# Altium project BRZ_BATT_MANAGER.PrjPcb (part 2 of 2)

## Sheet STM32H730_PINOUT.SchDoc
size D; SheetNumber: 2; SheetTotal: 8
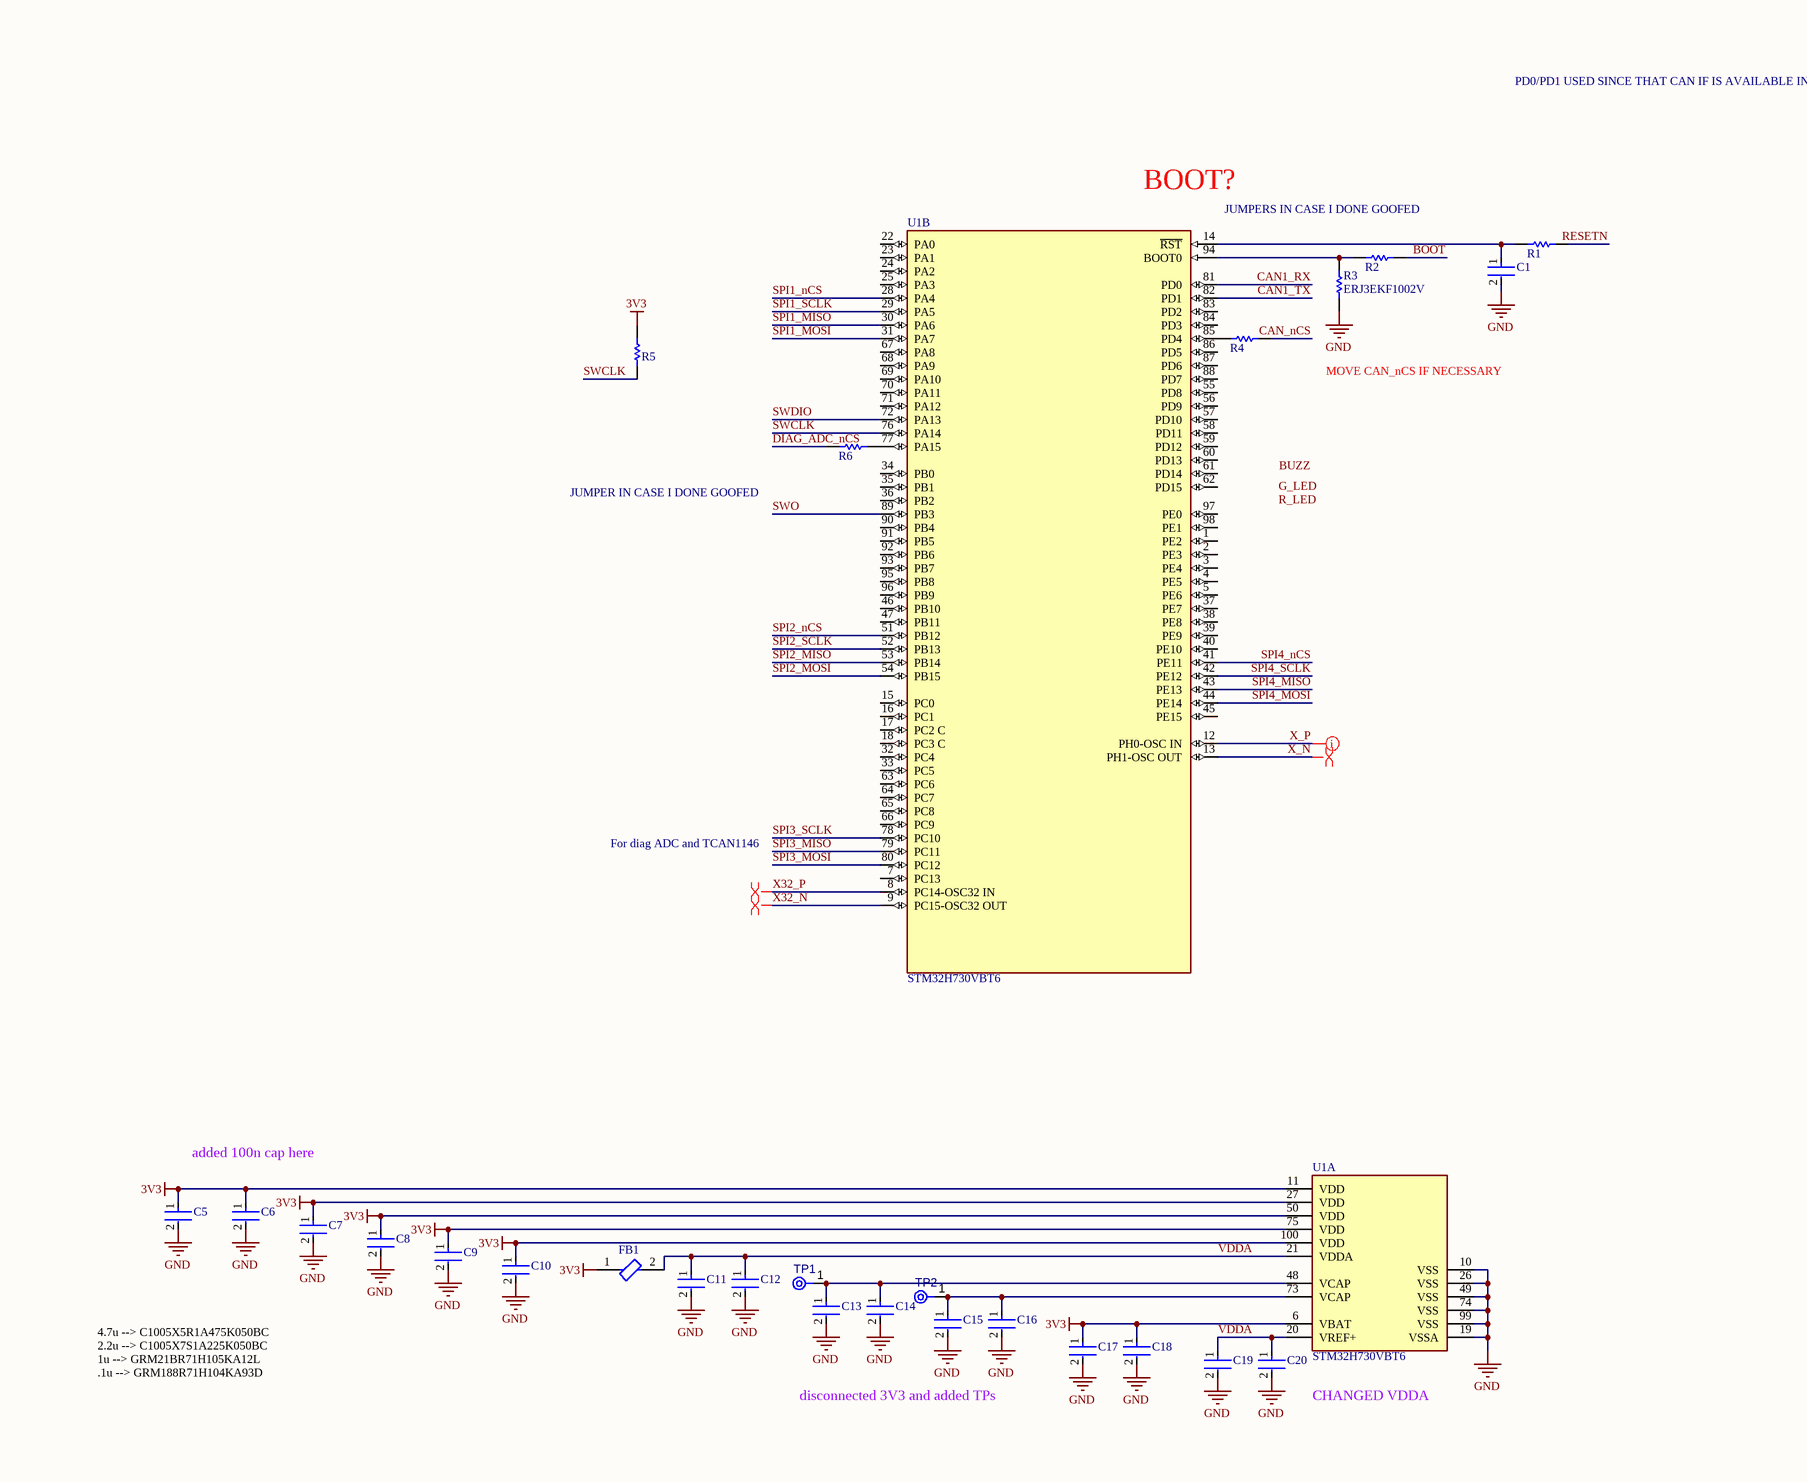
[diagram p5: STM32H730_PINOUT.SchDoc, top left]
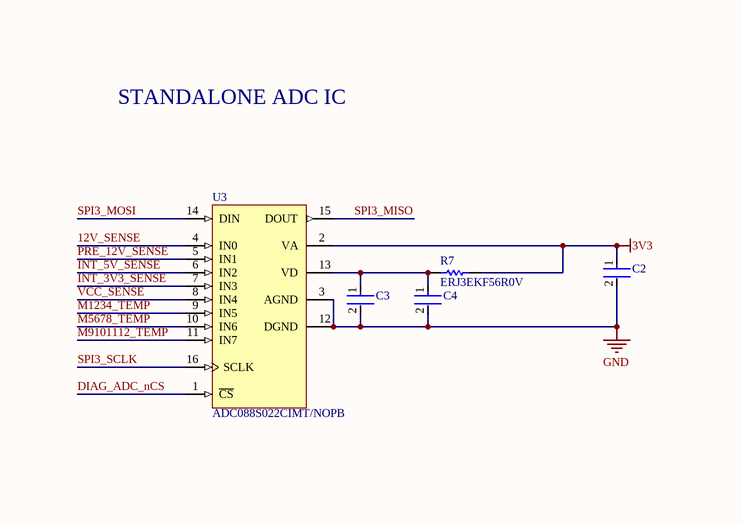
[diagram p6: STM32H730_PINOUT.SchDoc, top middle]
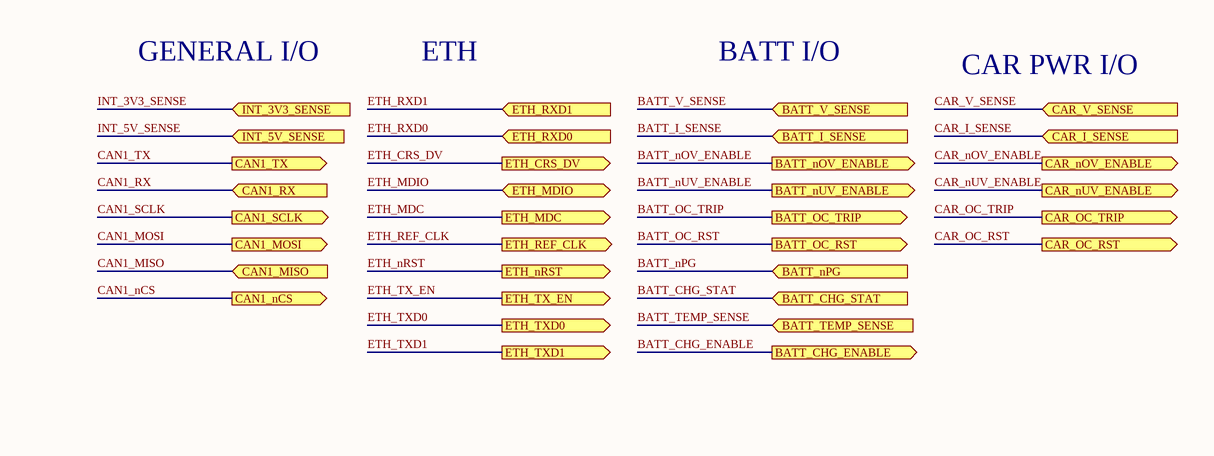
[diagram p7: STM32H730_PINOUT.SchDoc, top right]
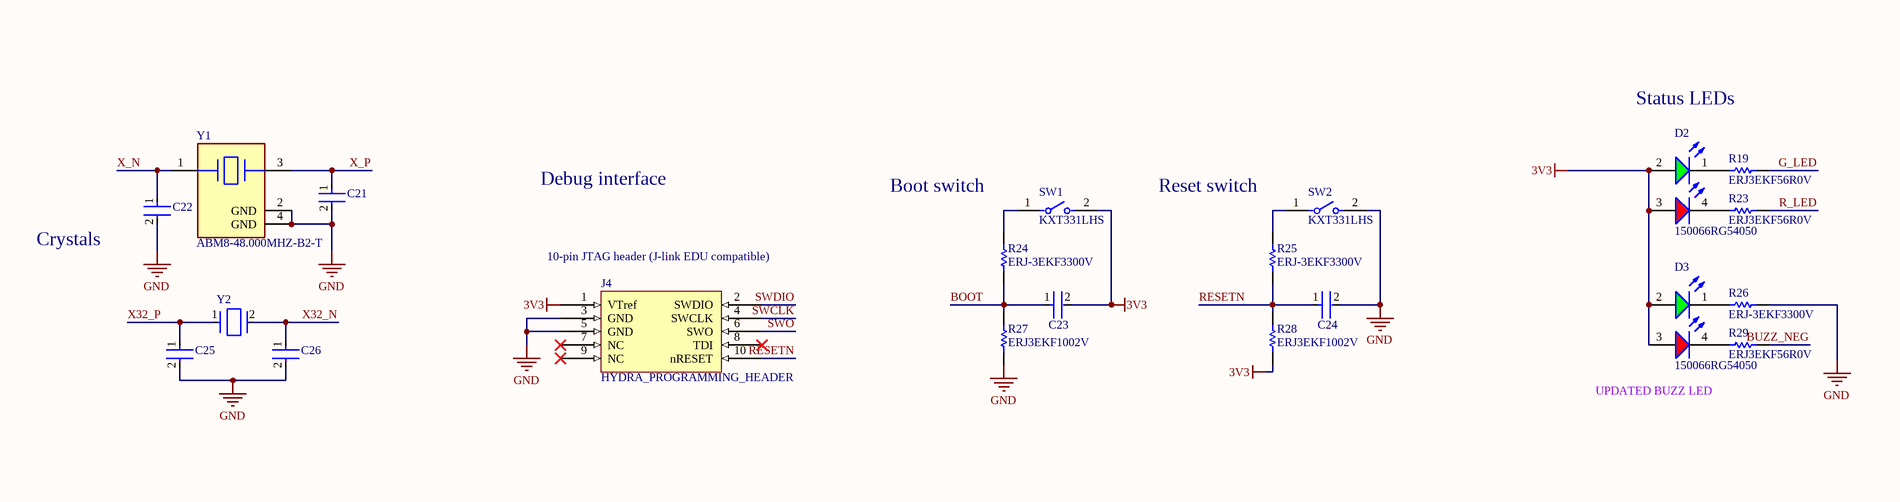
[diagram p8: STM32H730_PINOUT.SchDoc, bottom left]
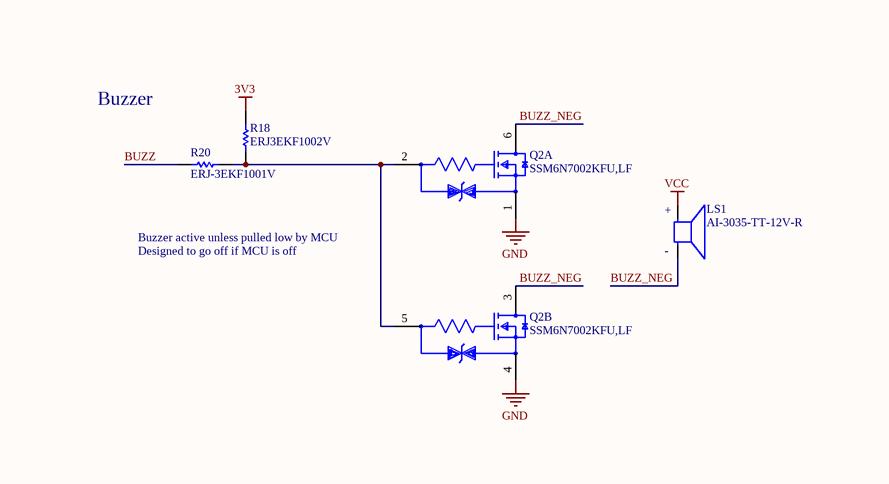
[diagram p9: STM32H730_PINOUT.SchDoc, bottom middle]
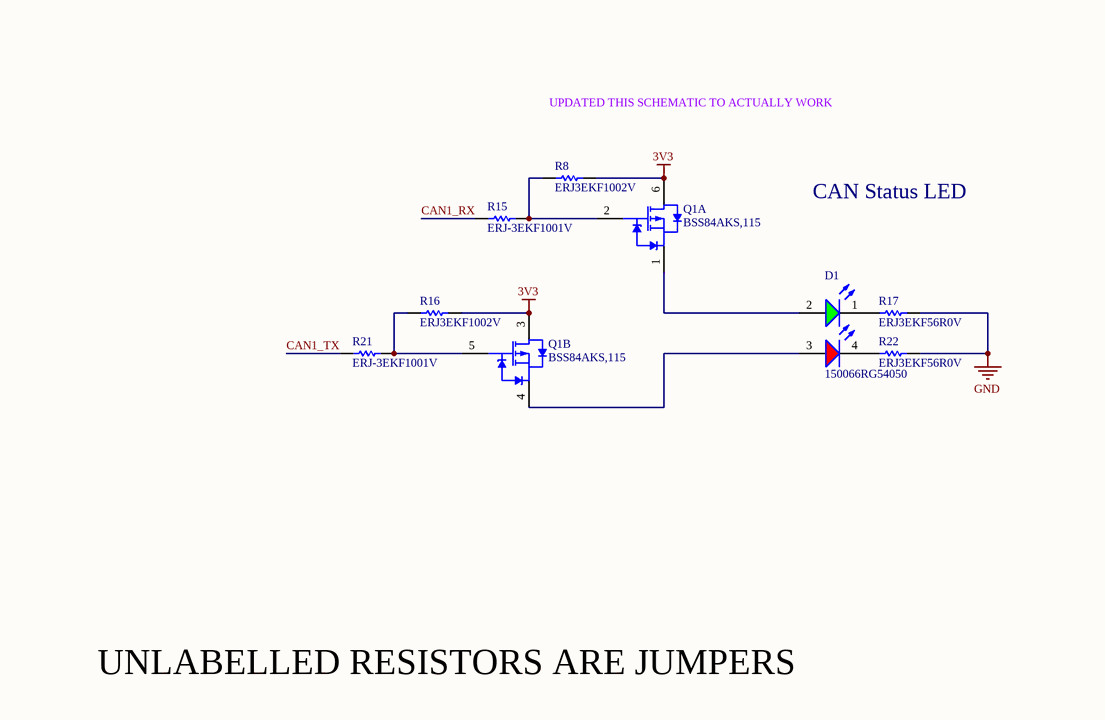
[diagram p10: STM32H730_PINOUT.SchDoc, bottom right]

### Parts
C1  GRM188R71H104KA93D  [FP-0402-L_1_0_0_05-W_0_5-IPC_A]  (value not drawn)
C2  GRM188R71H104KA93D  [FP-0402-L_1_0_0_05-W_0_5-IPC_A]  (value not drawn)
C3  GRM188R71H104KA93D  [FP-0402-L_1_0_0_05-W_0_5-IPC_A]  (value not drawn)
C4  GRM188R71H104KA93D  [FP-0402-L_1_0_0_05-W_0_5-IPC_A]  (value not drawn)
C5  C1005X5R1A475K050BC  [FP-0402-L_1_0_0_05-W_0_5-IPC_A]  (value not drawn)
C6  GRM188R71H104KA93D  [FP-0402-L_1_0_0_05-W_0_5-IPC_A]  (value not drawn)
C7  GRM188R71H104KA93D  [FP-0402-L_1_0_0_05-W_0_5-IPC_A]  (value not drawn)
C8  GRM188R71H104KA93D  [FP-0402-L_1_0_0_05-W_0_5-IPC_A]  (value not drawn)
C9  GRM188R71H104KA93D  [FP-0402-L_1_0_0_05-W_0_5-IPC_A]  (value not drawn)
C10  GRM188R71H104KA93D  [FP-0402-L_1_0_0_05-W_0_5-IPC_A]  (value not drawn)
C11  GRM21BR71H105KA12L  [FP-0402-L_1_0_0_05-W_0_5-IPC_A]  (value not drawn)
C12  GRM188R71H104KA93D  [FP-0402-L_1_0_0_05-W_0_5-IPC_A]  (value not drawn)
C13  C1005X7S1A225K050BC  [FP-0402-L_1_0_0_05-W_0_5-IPC_A]  (value not drawn)
C14  GRM188R71H104KA93D  [FP-0402-L_1_0_0_05-W_0_5-IPC_A]  (value not drawn)
C15  C1005X7S1A225K050BC  [FP-0402-L_1_0_0_05-W_0_5-IPC_A]  (value not drawn)
C16  GRM188R71H104KA93D  [FP-0402-L_1_0_0_05-W_0_5-IPC_A]  (value not drawn)
C17  GRM21BR71H105KA12L  [FP-0402-L_1_0_0_05-W_0_5-IPC_A]  (value not drawn)
C18  GRM188R71H104KA93D  [FP-0402-L_1_0_0_05-W_0_5-IPC_A]  (value not drawn)
C19  GRM21BR71H105KA12L  [FP-0402-L_1_0_0_05-W_0_5-IPC_A]  (value not drawn)
C20  GRM188R71H104KA93D  [FP-0402-L_1_0_0_05-W_0_5-IPC_A]  (value not drawn)
C21  DNO  [FP-0402-L_1_0_0_05-W_0_5-IPC_A]  (value not drawn)
C22  DNO  [FP-0402-L_1_0_0_05-W_0_5-IPC_A]  (value not drawn)
C23  GRM188R71H104KA93D  [FP-0402-L_1_0_0_05-W_0_5-IPC_A]  (value not drawn)
C24  GRM188R71H104KA93D  [FP-0402-L_1_0_0_05-W_0_5-IPC_A]  (value not drawn)
C25  04025A180FAT2A  [FP-0402-L_1_0_0_05-W_0_5-IPC_A]  (value not drawn)
C26  04025A180FAT2A  [FP-0402-L_1_0_0_05-W_0_5-IPC_A]  (value not drawn)
D1  150066RG54050  [WL-SBCD_0606]
D2  150066RG54050  [WL-SBCD_0606]
D3  150066RG54050  [WL-SBCD_0606]
FB1  BLM15PX601SN1D  [FP-BLM15-0_05-MFG]  (value not drawn)
J4  HYDRA_PROGRAMMING_HEADER  [3220-10-0300-00-Footprint-1]
LS1  AI-3035-TT-12V-R  [AI-3035-TT-12V-R-Footprint-1]
Q1  BSS84AKS,115  [NXP-SOT363_L]  (parts A,B of 2)
Q2  SSM6N7002KFU,LF  [FP-SSOP6-P-0_65A-MFG]  (parts A,B of 2)
R1  0402 JUMPER 0 OHM  [RESC1005X40X25NL05T05]  (value not drawn)
R2  0402 JUMPER 0 OHM  [RESC1005X40X25NL05T05]  (value not drawn)
R3  ERJ3EKF1002V  [RESC1609X55X30LL15T15]
R4  0402 JUMPER 0 OHM  [RESC1005X40X25NL05T05]  (value not drawn)
R5  ERJ3EKF1002V  [RESC1609X55X30LL15T15]  (value not drawn)
R6  0402 JUMPER 0 OHM  [RESC1005X40X25NL05T05]  (value not drawn)
R7  ERJ3EKF56R0V  [RESC1608X55X30NL15T15]
R8  ERJ3EKF1002V  [RESC1609X55X30LL15T15]
R15  ERJ-3EKF1001V  [RESC1608X55X30LL15T15]
R16  ERJ3EKF1002V  [RESC1609X55X30LL15T15]
R17  ERJ3EKF56R0V  [RESC1608X55X30NL15T15]
R18  ERJ3EKF1002V  [RESC1609X55X30LL15T15]
R19  ERJ3EKF56R0V  [RESC1608X55X30NL15T15]
R20  ERJ-3EKF1001V  [RESC1608X55X30LL15T15]
R21  ERJ-3EKF1001V  [RESC1608X55X30LL15T15]
R22  ERJ3EKF56R0V  [RESC1608X55X30NL15T15]
R23  ERJ3EKF56R0V  [RESC1608X55X30NL15T15]
R24  ERJ-3EKF3300V  [RESC1608X55X30LL15T15]
R25  ERJ-3EKF3300V  [RESC1608X55X30LL15T15]
R26  ERJ-3EKF3300V  [RESC1608X55X30LL15T15]
R27  ERJ3EKF1002V  [RESC1609X55X30LL15T15]
R28  ERJ3EKF1002V  [RESC1609X55X30LL15T15]
R29  ERJ3EKF56R0V  [RESC1608X55X30NL15T15]
SW1  KXT331LHS  [FP-KXT331LHS-MFG]
SW2  KXT331LHS  [FP-KXT331LHS-MFG]
TP1  TPAD6R  [TP06R]  (value not drawn)  (no BOM)
TP2  TPAD6R  [TP06R]  (value not drawn)  (no BOM)
U1  STM32H730VBT6  [FP-LQFP100-1L-IPC_C]  (parts A,B of 2)
U3  ADC088S022CIMT/NOPB  [MTC16_L]
Y1  ABM8-48.000MHZ-B2-T  [FP-ABM8-MFG]
Y2  ECS-.327-12.5-1210-TR  [FP-ECX-1210-MFG]  (value not drawn)

### Ports
BATT_CHG_ENABLE (out, see BRZ_BATT_MGR[4B]), BATT_CHG_STAT (in, see BRZ_BATT_MGR[4B]), BATT_I_SENSE (in, see BRZ_BATT_MGR[4B]), BATT_nOV_ENABLE (out, see BRZ_BATT_MGR[4B]), BATT_nPG (in, see BRZ_BATT_MGR[4B]), BATT_nUV_ENABLE (out, see BRZ_BATT_MGR[4B]), BATT_OC_RST (out, see BRZ_BATT_MGR[4B]), BATT_OC_TRIP (out, see BRZ_BATT_MGR[4B]), BATT_TEMP_SENSE (in, see BRZ_BATT_MGR[4B]), BATT_V_SENSE (in, see BRZ_BATT_MGR[4B]), CAN1_MISO (in, see BRZ_BATT_MGR[5A]), CAN1_MOSI (out, see BRZ_BATT_MGR[5A]), CAN1_nCS (out, see BRZ_BATT_MGR[5A]), CAN1_RX (in, see BRZ_BATT_MGR[5A]), CAN1_SCLK (out, see BRZ_BATT_MGR[5A]), CAN1_TX (out, see BRZ_BATT_MGR[5A]), CAR_I_SENSE (in, see BRZ_BATT_MGR[4C]), CAR_nOV_ENABLE (out, see BRZ_BATT_MGR[4C]), CAR_nUV_ENABLE (out, see BRZ_BATT_MGR[4C]), CAR_OC_RST (out, see BRZ_BATT_MGR[4C]), CAR_OC_TRIP (out, see BRZ_BATT_MGR[4C]), CAR_V_SENSE (in, see BRZ_BATT_MGR[4C]), ETH_CRS_DV (out, see BRZ_BATT_MGR[5C], ETH[1A]), ETH_MDC (out, see BRZ_BATT_MGR[5C], ETH[1A]), ETH_MDIO (bidir, see BRZ_BATT_MGR[5C], ETH[1A]), ETH_nRST (out, see BRZ_BATT_MGR[5C], ETH[1A]), ETH_REF_CLK (out, see BRZ_BATT_MGR[5C], ETH[1A]), ETH_RXD0 (in, see BRZ_BATT_MGR[5C], ETH[1A]), ETH_RXD1 (in, see BRZ_BATT_MGR[5C], ETH[1A]), ETH_TX_EN (out, see BRZ_BATT_MGR[5C], ETH[1A]), ETH_TXD0 (out, see BRZ_BATT_MGR[5C], ETH[1A]), ETH_TXD1 (out, see BRZ_BATT_MGR[5C], ETH[1A]), INT_3V3_SENSE (in, see BRZ_BATT_MGR[4A], INT_REG[4A]), INT_5V_SENSE (in, see BRZ_BATT_MGR[4A], INT_REG[4B])

### Nets
3V3: C2.1 C5.1 C6.1 C7.1 C8.1 C9.1 C10.1 C17.1 C18.1 C23.2 D2.2(A) D2.3(A) D3.2(A) D3.3(A) FB1.1 J4.1(VTref) Q1.3(D2) Q1.6(D1) R5.1 R7.1 R8.2 R16.2 R18.2 R28.1 SW1.2 U1.6(VBAT) U1.11(VDD) U1.27(VDD) U1.50(VDD) U1.75(VDD) U1.100(VDD) U3.2(VA)
GND: C1.2 C2.2 C3.2 C4.2 C5.2 C6.2 C7.2 C8.2 C9.2 C10.2 C11.2 C12.2 C13.2 C14.2 C15.2 C16.2 C17.2 C18.2 C19.2 C20.2 C21.2 C22.2 C24.2 C25.2 C26.2 J4.3(GND) J4.5(GND) Q2.1(Source1) Q2.4(Source2) R3.1 R17.1 R22.1 R26.2 R27.1 SW2.2 U1.10(VSS) U1.19(VSSA) U1.26(VSS) U1.49(VSS) U1.74(VSS) U1.99(VSS) U3.3(AGND) U3.12(DGND) Y1.2(GND) Y1.4(GND)
VCC: LS1.P
12V_SENSE: U3.4(IN0)
BOOT: C23.1 R2.2 R24.1 R27.2
BUZZ: R20.1
BUZZ_NEG: LS1.N Q2.3(Drain2) Q2.6(Drain1) R29.1
CAN1_RX: R15.1 U1.81(PD0) ; port CAN1_RX
CAN1_TX: R21.1 U1.82(PD1) ; port CAN1_TX
CAN_nCS: R4.2
DIAG_ADC_nCS: R6.1 U3.1(~{CS})
ETH_CRS_DV: port ETH_CRS_DV
ETH_MDC: port ETH_MDC
ETH_MDIO: port ETH_MDIO
ETH_nRST: port ETH_nRST
ETH_REF_CLK: port ETH_REF_CLK
ETH_RXD0: port ETH_RXD0
ETH_RXD1: port ETH_RXD1
ETH_TX_EN: port ETH_TX_EN
ETH_TXD0: port ETH_TXD0
ETH_TXD1: port ETH_TXD1
G_LED: R19.1
INT_3V3_SENSE: U3.7(IN3) ; port INT_3V3_SENSE
INT_5V_SENSE: U3.6(IN2) ; port INT_5V_SENSE
M1234_TEMP: U3.9(IN5)
M5678_TEMP: U3.10(IN6)
M9101112_TEMP: U3.11(IN7)
PRE_12V_SENSE: U3.5(IN1)
R_LED: R23.1
RESETN: C24.1 J4.10(nRESET) R1.2 R25.1 R28.2
SPI1_MISO: U1.30(PA6)
SPI1_MOSI: U1.31(PA7)
SPI1_nCS: U1.28(PA4)
SPI1_SCLK: U1.29(PA5)
SPI2_MISO: U1.53(PB14)
SPI2_MOSI: U1.54(PB15)
SPI2_nCS: U1.51(PB12)
SPI2_SCLK: U1.52(PB13)
SPI3_MISO: U1.79(PC11) U3.15(DOUT)
SPI3_MOSI: U1.80(PC12) U3.14(DIN)
SPI3_SCLK: U1.78(PC10) U3.16(SCLK)
SPI4_MISO: U1.43(PE13)
SPI4_MOSI: U1.44(PE14)
SPI4_nCS: U1.41(PE11)
SPI4_SCLK: U1.42(PE12)
SWCLK: J4.4(SWCLK) R5.2 U1.76(PA14)
SWDIO: J4.2(SWDIO) U1.72(PA13)
SWO: J4.6(SWO) U1.89(PB3)
VCC_SENSE: U3.8(IN4)
VDDA: C11.1 C12.1 C19.1 C20.1 FB1.2 U1.20(VREF+) U1.21(VDDA)
X32_N: C26.1 U1.9(PC15-OSC32_OUT) Y2.2(Out/In)
X32_P: C25.1 U1.8(PC14-OSC32_IN) Y2.1(In/Out)
X_N: C22.1 U1.13(PH1-OSC_OUT) Y1.1
X_P: C21.1 U1.12(PH0-OSC_IN) Y1.3
NetC1_1: C1.1 R1.1 U1.14(~{RST})
NetC3_1: C3.1 C4.1 R7.2 U3.13(VD)
NetC13_1: C13.1 C14.1 TP1.1(TP) U1.48(VCAP)
NetC15_1: C15.1 C16.1 TP2.1(TP) U1.73(VCAP)
NetD1_1: D1.1(K) R17.2
NetD1_2: D1.2(A) Q1.1(S1)
NetD1_3: D1.3(A) Q1.4(S2)
NetD1_4: D1.4(K) R22.2
NetD2_1: D2.1(K) R19.2
NetD2_4: D2.4(K) R23.2
NetD3_1: D3.1(K) R26.1
NetD3_4: D3.4(K) R29.2
NetQ1_2: Q1.2(G1) R8.1 R15.2
NetQ1_5: Q1.5(G2) R16.1 R21.2
NetQ2_2: Q2.2(Gate1) Q2.5(Gate2) R18.1 R20.2
NetR2_1: R2.1 R3.2 U1.94(BOOT0)
NetR4_1: R4.1 U1.85(PD4)
NetR6_2: R6.2 U1.77(PA15)
NetR24_2: R24.2 SW1.1
NetR25_2: R25.2 SW2.1

Not connected (* = marked no-connect by the designer): J4 7(NC)* 8(TDI)* 9(NC)*; U1 1(PE2) 2(PE3) 3(PE4) 4(PE5) 5(PE6) 7(PC13) 15(PC0) 16(PC1) 17(PC2_C) 18(PC3_C) 22(PA0) 23(PA1) 24(PA2) 25(PA3) 32(PC4) 33(PC5) 34(PB0) 35(PB1) 36(PB2) 37(PE7) 38(PE8) 39(PE9) 40(PE10) 45(PE15) 46(PB10) 47(PB11) 55(PD8) 56(PD9) 57(PD10) 58(PD11) 59(PD12) 60(PD13) 61(PD14) 62(PD15) 63(PC6) 64(PC7) 65(PC8) 66(PC9) 67(PA8) 68(PA9) 69(PA10) 70(PA11) 71(PA12) 83(PD2) 84(PD3) 86(PD5) 87(PD6) 88(PD7) 90(PB4) 91(PB5) 92(PB6) 93(PB7) 95(PB8) 96(PB9) 97(PE0) 98(PE1)

### Layout directives
differential pair: X32_N, X32_P, X_N, X_P

### Notes on the sheet
- GENERAL I/O
- ETH
- BATT I/O
- PD0/PD1 USED SINCE THAT CAN IF IS AVAILABLE IN BOOTLOADER MODE
- CAR PWR I/O
- (near U1) BOOT?
- JUMPERS IN CASE I DONE GOOFED
- MOVE CAN_nCS IF NECESSARY
- STANDALONE ADC IC
- JUMPER IN CASE I DONE GOOFED
- For diag ADC and TCAN1146
- added 100n cap here
- disconnected 3V3 and added TPs
- CHANGED VDDA
- 4.7u --> C1005X5R1A475K050BC
  2.2u --> C1005X7S1A225K050BC
  1u --> GRM21BR71H105KA12L
  .1u --> GRM188R71H104KA93D
- UPDATED THIS SCHEMATIC TO ACTUALLY WORK
- CAN Status LED
- Status LEDs
- Buzzer
- Debug interface
- Boot switch
- Reset switch
- (near C22) Crystals
- (near J4) 10-pin JTAG header (J-link EDU compatible)
- Buzzer active unless pulled low by MCU
- Designed to go off if MCU is off
- UPDATED BUZZ LED
- UNLABELLED RESISTORS ARE JUMPERS
- Labels drawn without touching a wire or pin: BUZZ, G_LED, R_LED
- (in symbol CMP-00027-00003-1) +; -

### Library data of the parts
C1-C26 = CMP-001-00058-1: LARGE PADS, 0402 CAP, CHANGE COMMENT TO MATCH REAL P/N; Capacitor Type: Ceramic; Min Operating Temperature: -55°C; Mounting Technology: Surface Mount; Pins: 2; Case/Package: 0402; RoHS Compliant: Yes; Max Operating Temperature: 85°C
D1-D3 = CMP-004-00034-2: Led, Red/Grn, 180Mcd/230Mcd, 624Nm/525Nm Rohs Compliant: Yes
FB1 = CMP-0686-00252-4: Chip Ferrite Bead, 0402, 600Ω @ 100MHz, 0.23Ω, 25%, 900mA; Number of Circuits: 1; Impedance: 600R; DC Resistance (DCR): 230mR; Material: Steel; Length: 1mm; Package Quantity: 10000; Height: 0.5mm; Width: 0.5mm; Max DC Current: 900mA; Number of Lines: 1; Termination: SMD/SMT; Packaging: Tape and Reel; Lead Free: Lead Free; Min Operating Temperature: -55°C; Max Operating Temperature: 125°C; Max Current Rating: 900mA; Case Code (Imperial): 0402; Number of Pins: 2; Current Rating: 900mA; Test Frequency: 100MHz; Case/Package: 0402; Tolerance: 25%; Case Code (Metric): 1005
J4 = CMP-002-00075-1: CONN HEADER SMD 10POS 1.27MM (specifically compatible with J-Link EDU cable) PN: 3220-10-0300-00
LS1 = CMP-00027-00003-1: Audio Indicator 12V 12mA 110dBA 3.5KHz Resonant Frequency Thru-Hole
Q1 = CMP-1259-00116-1: Dual P-Channel Trench MOSFET, -50 V, -0.16 A, -55 to 150 degC, 6-Pin SOT363, Tape and Reel; Manufacturer: NXP Semiconductors; VGSth [typ] (V): -1.6; Automotive Qualified: Y; Channel Type: P; IDM [max] (A): -0.64; Packing: Tape & Reel; Mounting Technology: Surface Mount; PackageDescription: 6-Pin Small Outline Transistor Package, Body 2 x 1.25 mm, Pitch 0.65 mm; ComponentLink2URL: http://www.nxp.com/documents/data_sheet/BSS84AKS.pdf; ComponentLink3URL: http://www.nxp.com/documents/outline_drawing/sot363_po.pdf; PartNumber: BSS84AKS,115; PackageReference: SOT363; PackageVersion: 06-03-16, 03/2006; ComponentLink3Description: Package Specification; ComponentLink2Description: Datasheet; ComponentLink1Description: Manufacturer URL; VDS [max] (V): -50; Code_JEITA: SC-88; ID [max] (A): -0.16; DatasheetVersion: Rev. 1; ComponentLink1URL: http://www.nxp.com/
Q2 = CMP-35916-000009-1: MOSFET 2N-CH 60V 0.3A; Input Capacitance: 40pF; Continuous Drain Current (ID): 300mA; Max Power Dissipation: 285mW; FET Type: 2 N-Channel; Rds On Max: 1.5R; Mount: Surface Mount; Drain to Source Voltage (Vdss): 60V; Packaging: Tape and Reel
R1 R2 R4 R6 = CMP-009-00206-2: READ THE NAME
R3 R5 R8 R16 R18 R27 R28 = CMP-1012-00623-3: Chip Resistor, 10 KOhm, +/- 1%, 0.1 W, -55 to 155 degC, 0603 (1608 Metric), RoHS, Tape and Reel; Manufacturer: Panasonic; Voltage Rating: 75V; Case\/Package: 0603; Power Rating: 100mW; Resistance: 10KOhm; Temperature Coefficient: 100ppm\/degreesC; Number of Pins: 2; Package Reference: 603; Depth: 0.8mm; Mount: SurfaceMount; Package Description: 2-Pin Surface Mount Device, Body 1.6 x 0.85 mm; Datasheet Version: 02/2017; Length: 1.6mm; Lead Free: LeadFree; Height: 0.45mm; Number of Terminations: 2; Max Power Dissipation: 100mW; Min Operating Temperature: -55degC; Datasheet URL: https://industrial.panasonic.com/cdbs/www-data/pdf/RDA0000/AOA0000C304.pdf; Termination: SMD/SMT; Case Code (Metric): 1608; Case Code (Imperial): 0603; Tolerance: 1%; Max Operating Temperature: 155degC; RoHSCompliant: true; Voltage Rating (DC): 75V; Radiation Hardening: No; Packaging: TapeandReel; Composition: ThickFilm; Mounting Technology: SurfaceMount; Manufacturer URL: http://www.panasonic.com/; Width: 0.031inch; REACH SVHC: NoSVHC; Contact Plating: Tin; Military Standard: Not; Package Quantity: 1
R7 R17 R19 R22 R23 R29 = CMP-2000-00572-1: Manufacturer: Panasonic; Part Number: ERJ3EKF56R0V
R15 R20 R21 = CMP-2000-00180-1: Manufacturer: Panasonic; Part Number: ERJ-3EKF1001V
R24-R26 = CMP-2000-00435-2: Chip Resistor, 330 Ohm, +/- 1%, 0.1 W, -55 to 155 degC, 0603 (1608 Metric), RoHS, Tape and Reel; Gender: Male; Mating Cycles: 10000; Current Rating: 500 mA; Voltage Rating: 10 V; REACH SVHC: No SVHC; PackageDescription: 2-Pin Surface Mount Device, Body 1.6 x 0.85 mm; Contact Finish: Gold; Pins: 8; ComponentLink1Description: Manufacturer URL; Packaging: Tape and Reel; Max Operating Temperature: 85 degC; Contact Material: Copper; Height: 1.45 mm; Width: 1.45 mm; DatasheetVersion: Apr-15; Package Quantity: 1500; Contact Plating: Gold; PackageReference: 0603; Mount: Surface Mount; Lead Pitch: 1.1 mm; Min Operating Temperature: -25 degC; ComponentLink1URL: http://www.panasonic.com/; ComponentLink2URL: http://industrial.panasonic.com/cdbs/www-data/pdf/RDA0000/AOA0000C86.pdf; Length: 13.7 mm; ComponentLink2Description: Datasheet; RoHSCompliant: true
SW1 SW2 = CMP-10040-000029-1: SWITCH TACTILE SPST-NO 0.02A 15V; Operating Force: 240gf; Switch Travel: 0.13mm; Illumination Type: Non-Illuminated; Throw Configuration: SPST; Number of Ports: 1; Current Rating: 5A; Mechanical Life: 500000Cycles; Switch Function: Off-Mom; Connector Type: USB; Actuator Type: Standard; Gender: Receptacle; Number of Contacts: 24; Contact Plating: Gold; Insulation Color: Black; Min Operating Temperature: -40°C; Packaging: Tape and Reel; Flammability Rating: UL94 V-0; Max Operating Temperature: 85°C; Termination: Solder; Mount: Surface Mount
TP1 TP2 = CMP-00028-00002-2: 0.6mm round; Pins: 1
U1 = CMP-12105-000107-1: IC MCU 32BIT 128KB FLASH 100LQFP
U3 = CMP-0054-00372-2: 8-Channel, 50 kSPS to 200 kSPS, 8-Bit A/D Converter, 16-pin TSSOP, Pb-Free; Manufacturer: National Semiconductor; PackageTopMarking: NSUZXYTT*88S022*CIMT; CompType: ADC IC; PowerWise: Y; ComponentLink2URL: http://www.national.com/pf/AD/ADC088S022.html; RoHS: Y; PackageDescription: Molded TSSOP, Jedec, 5 x 4.4 x 0.9mm Body, 16 Lead, 0.65mm Pitch; DatasheetVersion: Feb-2010; PinCount: 16; ComponentLink1Description: ADC088S022 Datasheet; Code_JEDEC: MO-153-AB; ComponentLink3URL: http://www.national.com/packaging/folders/mtc16.html; PackageVersion: revD, Jun-2003; ComponentLink3Description: MTC16 Package Page; RevisionNote: Component URLs added; ComponentLink1URL: http://www.national.com/ds/AD/ADC088S022.pdf; ComponentLink2Description: ADC088S022 Web Page; PackageReference: MTC16
Y1 = CMP-27762-011708-1: Crystal 48MHz ±20ppm 18pF SMD-4 3.2mm x 2.5mm; Series Resistance: 35R; Frequency Stability: 50ppm; Package Quantity: 1000; Packaging: Tape and Reel; Mount: Surface Mount; Length: 3.2mm; Load Capacitance: 18pF; Max Operating Temperature: 70°C; Operating Frequency: 48 MHz; RoHS Compliant: Yes; Series: ABM8; Frequency Tolerance: 20ppm; Lead Free: Lead Free; Min Operating Temperature: -20°C; Case/Package: CSMD; Number of Pins: 4; Height: 0.031inch; ESR (Equivalent Series Resistance): 35R; Frequency: 48MHz; Radiation Hardening: No; Width: 0.098inch; Tolerance: 20ppm; Termination: SMD/SMT; Depth: 2.5mm; Resistor Type: Ceramic; REACH SVHC: No SVHC
Y2 = CMP-40224-000006-1: CRYSTAL 32.7680KHZ 12.5PF SMD; Manufacturer: ECS International; Frequency: 32.768kHz; Esr: 90kΩ; Tolerance: 20ppm; Device Class L1: Passive Components; Load Capacitance: 12.5pF; Temperature: -40°C to +85°C; ComponentLink2URL: https://ecsxtal.com/store/pdf/ECX-1210.pdf; Series: ECX-1210; Octopart: https://octopart.com/ecs-.327-12.5-1210-tr-ecs+international-81221340; ComponentLink2Description: Datasheet; Temperature Range Low: -40°C; Digikey Description: CRYSTAL 32.7680KHZ 12.5PF SMD; Lead Free: Yes; RoHS: TRUE; Device Class L3: Crystals; Automotive: No; Category: Crys; Height: 0.5mm; Manufacturer Part Number: ECS-.327-12.5-1210-TR; Temperature Range High: +85°C; Device Class L2: Crystals / Oscillators; Package: ECX-1210

## Sheet CAN_IF.SchDoc
size B; SheetNumber: 8; SheetTotal: 8
Used 2 times, as channels CAN_IF_0, CAN_IF_1. Parts and nets are listed once, with the designators drawn on the sheet.
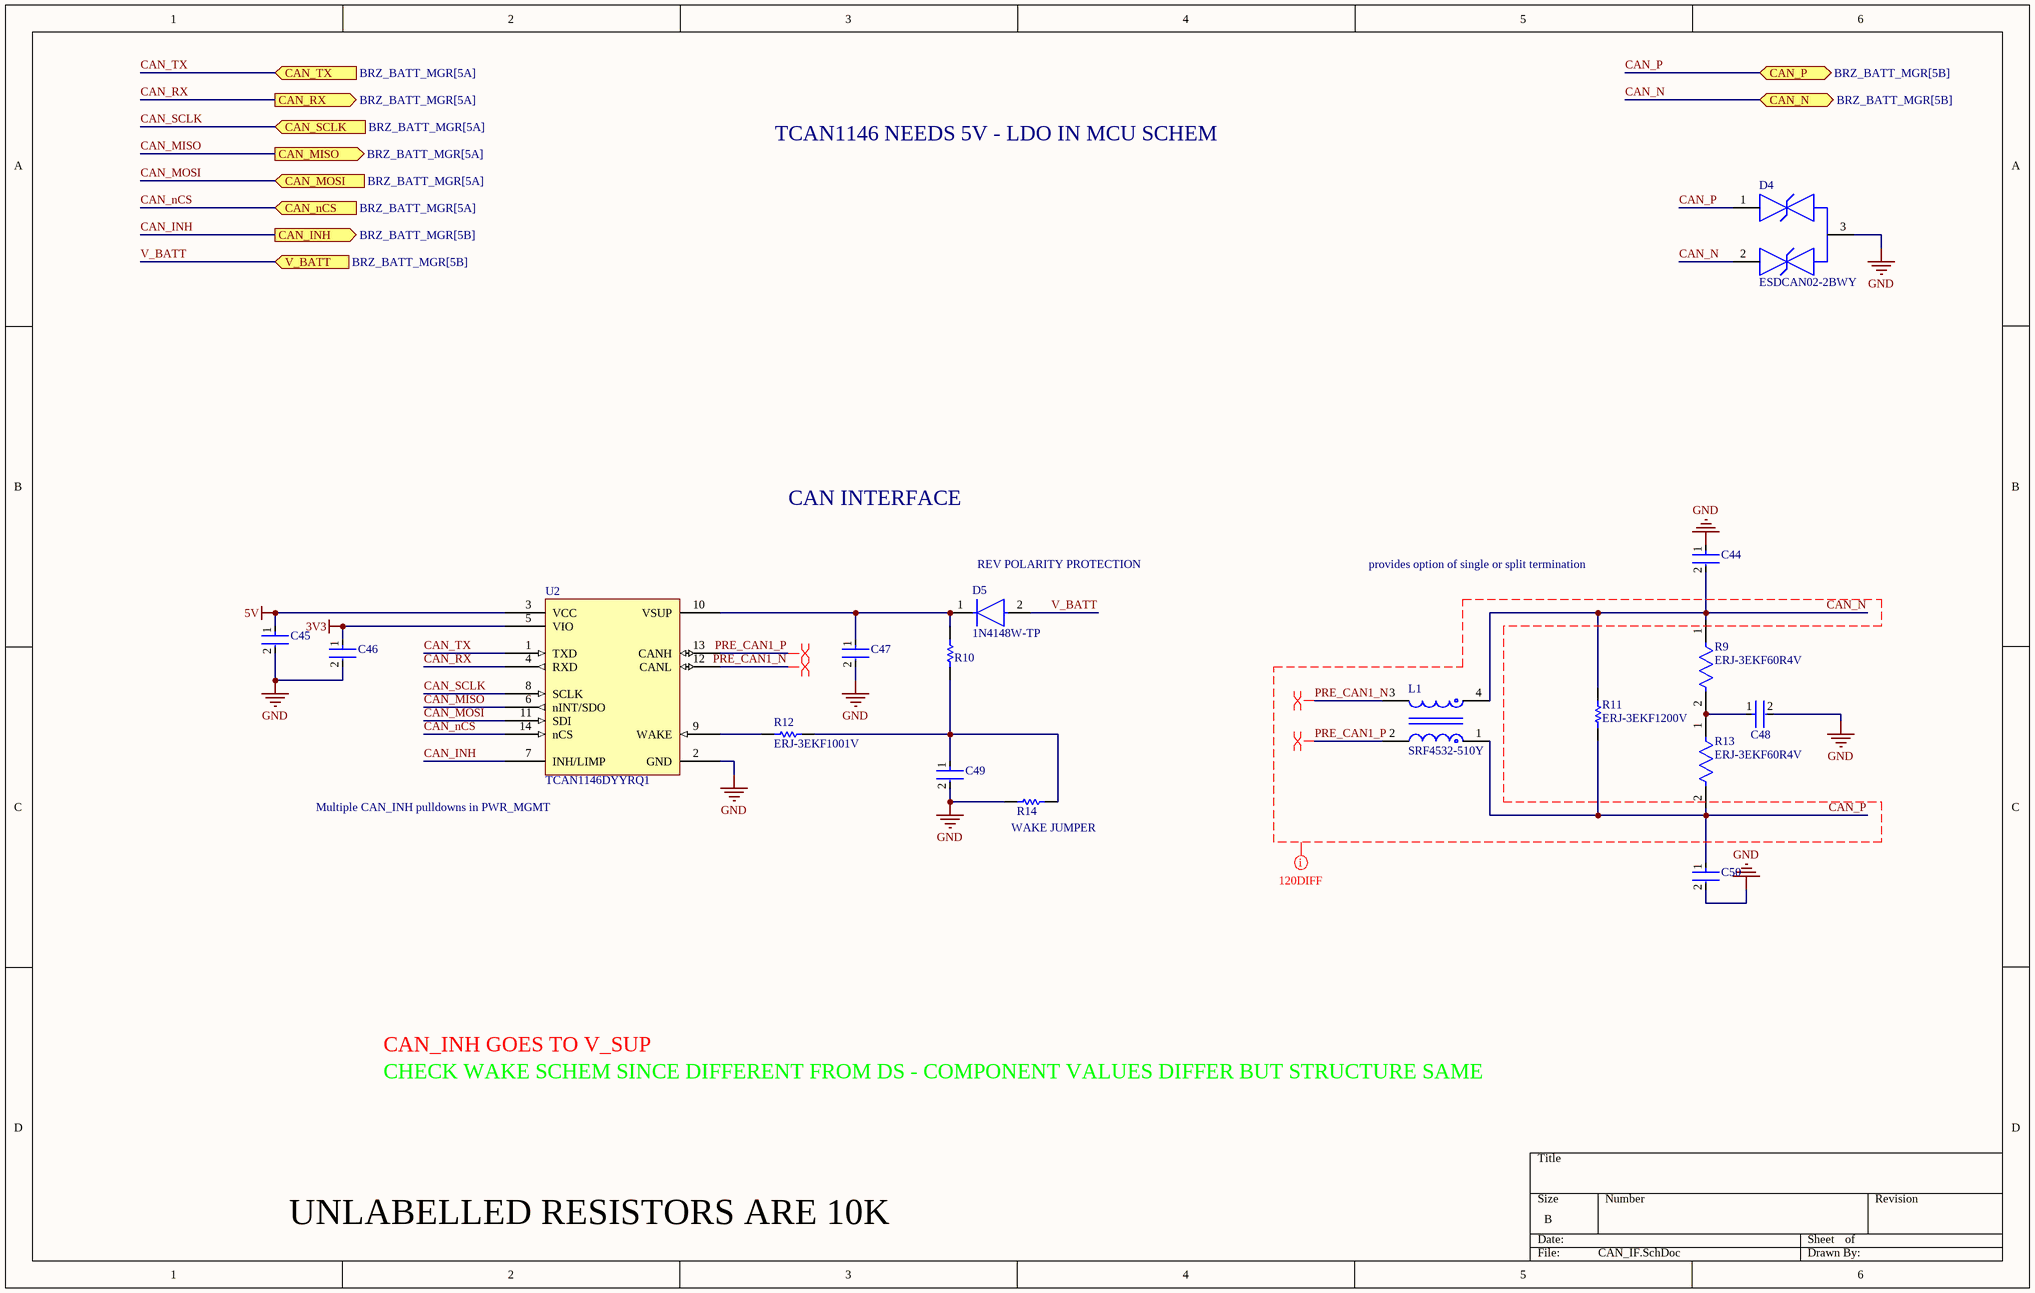
[diagram p11: CAN_IF.SchDoc]

### Parts
C44  DNO  [FP-0402-L_1_0_0_05-W_0_5-IPC_A]  (value not drawn)
C45  GRM188R71H104KA93D  [FP-0402-L_1_0_0_05-W_0_5-IPC_A]  (value not drawn)
C46  GRM188R71H104KA93D  [FP-0402-L_1_0_0_05-W_0_5-IPC_A]  (value not drawn)
C47  GRM188R71H104KA93D  [FP-0402-L_1_0_0_05-W_0_5-IPC_A]  (value not drawn)
C48  GRM188R71H104KA93D  [FP-0402-L_1_0_0_05-W_0_5-IPC_A]  (value not drawn)
C49  GRM188R71H104KA93D  [FP-0402-L_1_0_0_05-W_0_5-IPC_A]  (value not drawn)
C50  DNO  [FP-0402-L_1_0_0_05-W_0_5-IPC_A]  (value not drawn)
D4  ESDCAN02-2BWY  [FP-SOT323-3L-MFG]
D5  1N4148W-TP  [FP-SOD-123-IPC_A]
L1  SRF4532-510Y  [FP-SRF4532-MFG]
R9  ERJ-3EKF60R4V  [FP-ERJ3EK-IPC_C]
R10  ERJ3EKF1002V  [RESC1609X55X30LL15T15]  (value not drawn)
R11  ERJ-3EKF1200V  [RESC1609X55X30ML15T15]
R12  ERJ-3EKF1001V  [RESC1608X55X30LL15T15]
R13  ERJ-3EKF60R4V  [FP-ERJ3EK-IPC_C]
R14  0402 JUMPER 0 OHM  [RESC1005X40X25NL05T05]  (value not drawn)
U2  TCAN1146DYYRQ1  [TCAN1146DYYRQ1-Footprint-1]

### Ports
CAN_INH (out, see BRZ_BATT_MGR[5B]), CAN_MISO (out, see BRZ_BATT_MGR[5A]), CAN_MOSI (in, see BRZ_BATT_MGR[5A]), CAN_N (bidir, see BRZ_BATT_MGR[5B]), CAN_nCS (in, see BRZ_BATT_MGR[5A]), CAN_P (bidir, see BRZ_BATT_MGR[5B]), CAN_RX (out, see BRZ_BATT_MGR[5A]), CAN_SCLK (in, see BRZ_BATT_MGR[5A]), CAN_TX (in, see BRZ_BATT_MGR[5A]), V_BATT (in, see BRZ_BATT_MGR[5B])

### Nets
3V3: C46.1 U2.5(VIO)
5V: C45.1 U2.3(VCC)
GND: C44.1 C45.2 C46.2 C47.2 C48.2 C49.2 C50.2 D4.3 R14.1 U2.2(GND)
CAN_INH: U2.7(INH/LIMP) ; port CAN_INH
CAN_MISO: U2.6(nINT/SDO) ; port CAN_MISO
CAN_MOSI: U2.11(SDI) ; port CAN_MOSI
CAN_N: C44.2 D4.2 L1.4 R9.1 R11.1 ; port CAN_N
CAN_nCS: U2.14(nCS) ; port CAN_nCS
CAN_P: C50.1 D4.1 L1.1 R11.2 R13.2 ; port CAN_P
CAN_RX: U2.4(RXD) ; port CAN_RX
CAN_SCLK: U2.8(SCLK) ; port CAN_SCLK
CAN_TX: U2.1(TXD) ; port CAN_TX
PRE_CAN1_N: L1.3 U2.12(CANL)
PRE_CAN1_P: L1.2 U2.13(CANH)
V_BATT: D5.2(A) ; port V_BATT
NetC47_1: C47.1 D5.1(C) R10.1 U2.10(VSUP)
NetC48_1: C48.1 R9.2 R13.1
NetC49_1: C49.1 R10.2 R12.2 R14.2
NetR12_1: R12.1 U2.9(WAKE)

### Channels
CAN_IF_0: designators end in _CAN_IF_0; ports CAN_INH=CAN_INH CAN_MISO=CAN1_MISO CAN_MOSI=CAN1_MOSI CAN_N=CAN_N_CAN_IF_0 CAN_nCS=CAN1_nCS CAN_P=CAN_P_CAN_IF_0 CAN_RX=CAN1_RX CAN_SCLK=CAN1_SCLK CAN_TX=CAN1_TX V_BATT=PWR_IN
CAN_IF_1: designators end in _CAN_IF_1; ports CAN_INH=CAN_INH CAN_MISO=CAN_MISO_CAN_IF_1 CAN_MOSI=CAN_MOSI_CAN_IF_1 CAN_N=CAN_N_CAN_IF_1 CAN_nCS=CAN_nCS_CAN_IF_1 CAN_P=CAN_P_CAN_IF_1 CAN_RX=CAN_RX_CAN_IF_1 CAN_SCLK=CAN_SCLK_CAN_IF_1 CAN_TX=CAN_TX_CAN_IF_1 V_BATT=CAN_PWR

### Layout directives
differential pair: PRE_CAN1_N_CAN_IF_0, PRE_CAN1_P_CAN_IF_0
net class 120DIFF: CAN_N, CAN_P, PRE_CAN1_N, PRE_CAN1_P

### Notes on the sheet
- TCAN1146 NEEDS 5V - LDO IN MCU SCHEM
- CAN INTERFACE
- (near D5) REV POLARITY PROTECTION
- provides option of single or split termination
- (near U2) Multiple CAN_INH pulldowns in PWR_MGMT
- (near R14) WAKE JUMPER
- CHECK WAKE SCHEM SINCE DIFFERENT FROM DS - COMPONENT VALUES DIFFER BUT STRUCTURE SAME
- CAN_INH GOES TO V_SUP
- UNLABELLED RESISTORS ARE 10K

### Library data of the parts
C44-C50 = CMP-001-00058-1: as C1 on sheet STM32H730_PINOUT; Min Operating Temperature: -55°C; Mounting Technology: Surface Mount; Pins: 2; Case/Package: 0402; RoHS Compliant: Yes; Max Operating Temperature: 85°C
D4 = CMP-12225-000055-1: TVS DIODE 26.5V 44V SOT323-3; Manufacturer: STMicroelectronics; Value: 3pF; Direction: Bidirectional; Breakdown Voltage: 28.5V; Automotive Grade: Grade 0; Standoff Height: 0mm; Peak Pulse Power: 170W; Peak Pulse Current: 3A; Number Of Channels: 2; Max Junction Temp: +175°C; Mouser Description: TVS Diodes / ESD Suppressors Automotive dual-line Transil, Transient voltage suppressor (TVS) for CAN bus; Height: 1.1mm; Category: Diode; Reverse Standoff Voltage: 26.5V; Device Class L1: Circuit Protection; Temperature: -55°C to +175°C; RoHS: TRUE; ComponentLink2URL: https://www.st.com/resource/en/datasheet/esdcan02-2bwy.pdf; Device Class L3: unset; Device Class L2: TVS Diodes; Temperature Range High: +175°C; Octopart: https://octopart.com/esdcan02-2bwy-stmicroelectronics-58631133; Ipc Land Pattern Name: SOT65P210X95-3; Temperature Range Low: -55°C; Capacitance: 3pF; Digikey Description: TVS DIODE 26.5V 44V SOT323-3; Automotive: Yes; ComponentLink2Description: Datasheet; Clamping Voltage: 44V; Manufacturer Part Number: ESDCAN02-2BWY; Lead Free: Yes; Package: SOT323-3L
D5 = CMP-2000-04993-2: DIODE GEN PURP 100V 150MA SOD123; Max Reverse Leakage Current: 5uA; Max Surge Current: 2A; Reverse Recovery Time: 4ns; Polarity: Standard; Capacitance: 4pF; Max Forward Surge Current (Ifsm): 1A; Element Configuration: Single; Power Dissipation: 400mW; Forward Voltage: 1V; Radiation Hardening: No; Lead Free: Lead Free; Max Reverse Voltage (DC): 100V; Current Rating: 150mA; Forward Current: 150mA; Packaging: Tape and Reel; Number of Pins: 2; Package Quantity: 3000; Max Operating Temperature: 150°C; Min Operating Temperature: -65°C; Average Rectified Current: 150mA; Recovery Time: 4ns; Output Current: 150mA; Peak Non-Repetitive Surge Current: 2A; Width: 1.8mm; Voltage Rating (DC): 100V; Height: 1.2mm; Max Repetitive Reverse Voltage (Vrrm): 100V; Mount: Surface Mount; Length: 2.85mm
L1 = CMP-07251-000006-1: CMC 51UH 200MA 2LN 2KOHM SMD; Element Configuration: Dual; Number of Lines: 2; Core Material: Ferrite; Impedance: 2kR; Test Frequency: 100kHz; Voltage Rating (DC): 50V; Insulation Resistance: 10MR; Material: Steel; Tolerance: 50%; DC Resistance (DCR): 3.5R; RoHS Compliant: Yes; Mount: Surface Mount; REACH SVHC: No SVHC; Termination: SMD/SMT; DC Current: 200mA; Current: 200mA; Lead Free: Lead Free; Contact Plating: Tin; Length: 4.5mm; Max DC Current: 200mA; Width: 0.126inch; Case/Package: 4532; Packaging: Tape and Reel; Package Quantity: 1; Min Operating Temperature: -40°C; Depth: 3.4mm; Series: SRF4532; Max Operating Temperature: 125°C; Current Rating: 200mA; Self Resonant Frequency: 100kHz; Height: 0.118inch; Inductance: 51uH; Resistance: 2kR
R9 R13 = CMP-1012-00372-3: RES SMD 60.4 OHM 1% 1/10W 0603; Resistance: 60.4R; Voltage Rating (DC): 50V; Voltage Rating: 75V; Temperature Coefficient: 100ppm/°C; Power Rating: 100mW; Mount: Surface Mount; Number of Terminations: 2; Max Operating Temperature: 155°C; Case Code (Metric): 1608; Height: 0.022inch; Case/Package: 0603; Min Operating Temperature: -55°C; REACH SVHC: No SVHC; Series: ERJ; Features: Automotive AEC-Q200; Military Standard: Not; Lead Free: Lead Free; Width: 0.031inch; Case Code (Imperial): 0603; Resistance Tolerance: 1%; Packaging: Tape and Reel; Termination: SMD/SMT; Tolerance: 1%; Contact Plating: Tin; Depth: 0.8mm; Resistor Type: Thick Film; Construction: Rectangular; RoHS Compliant: Yes; Max Power Dissipation: 100mW; Package Quantity: 1; Length: 1.6mm
R10 = CMP-1012-00623-3: as R3 on sheet STM32H730_PINOUT; Number of Pins: 2; Package Reference: 603; Depth: 0.8mm; Mount: SurfaceMount; Package Description: 2-Pin Surface Mount Device, Body 1.6 x 0.85 mm; Datasheet Version: 02/2017; Length: 1.6mm; Lead Free: LeadFree; Height: 0.45mm; Number of Terminations: 2; Max Power Dissipation: 100mW; Min Operating Temperature: -55degC; Datasheet URL: https://industrial.panasonic.com/cdbs/www-data/pdf/RDA0000/AOA0000C304.pdf; Termination: SMD/SMT; Case Code (Metric): 1608; Case Code (Imperial): 0603; Tolerance: 1%; Max Operating Temperature: 155degC; RoHSCompliant: true; Voltage Rating (DC): 75V; Radiation Hardening: No; Packaging: TapeandReel; Composition: ThickFilm; Mounting Technology: SurfaceMount; Manufacturer URL: http://www.panasonic.com/; Width: 0.031inch; REACH SVHC: NoSVHC; Contact Plating: Tin; Military Standard: Not; Package Quantity: 1
R11 = CMP-2000-00213-2: Chip Resistor, 120 Ohm, +/- 1%, 0.1 W, -55 to 155 degC, 0603 (1608 Metric), RoHS, Tape and Reel; Manufacturer: Panasonic; Power Rating: 100mW; Voltage Rating (DC): 75V; Resistance: 120Ohm; Temperature Coefficient: 100ppm/degreesC; Number of Terminations: 2; Military Standard: Not; Tolerance: 1%; Min Operating Temperature: -55degC; Packaging: TapeandReel; Lead Free: LeadFree; Max Operating Temperature: 155degC; Manufacturer URL: http://www.panasonic.com/; Case Code (Imperial): 0603; REACH SVHC: NoSVHC; Width: 0.031inch; Datasheet URL: https://industrial.panasonic.com/cdbs/www-data/pdf/RDA0000/AOA0000C283.pdf; RoHSCompliant: true; Max Power Dissipation: 100mW; Termination: SMD/SMT; Package Reference: 0603; Height: 0.022inch; Depth: 0.8mm; Package Description: 2-Pin Surface Mount Device, Body 1.6 x 0.85 mm; Contact Plating: Tin; Length: 1.6mm; Package URL: http://www.st.com/st-web-ui/static/active/en/resource/technical/document/datasheet/CD00001320.pdf; Radiation Hardening: No; Package Quantity: 1; Number of Pins: 2; Datasheet Version: 42095.0; Voltage Rating: 75V; Composition: ThickFilm; Case/Package: 0603; Mount: SurfaceMount; Case Code (Metric): 1608
R12 = CMP-2000-00180-1: Manufacturer: Panasonic; Part Number: ERJ-3EKF1001V
R14 = CMP-009-00206-2: READ THE NAME
U2 = CMP-015-00012-2: Automotive CAN FD transceiver with watchdog, bus diagnostics and partial networking via sele 14-SOT-23-THIN -40 to 150

## Sheet ETH.SchDoc
size C; SheetNumber: 7; SheetTotal: 8
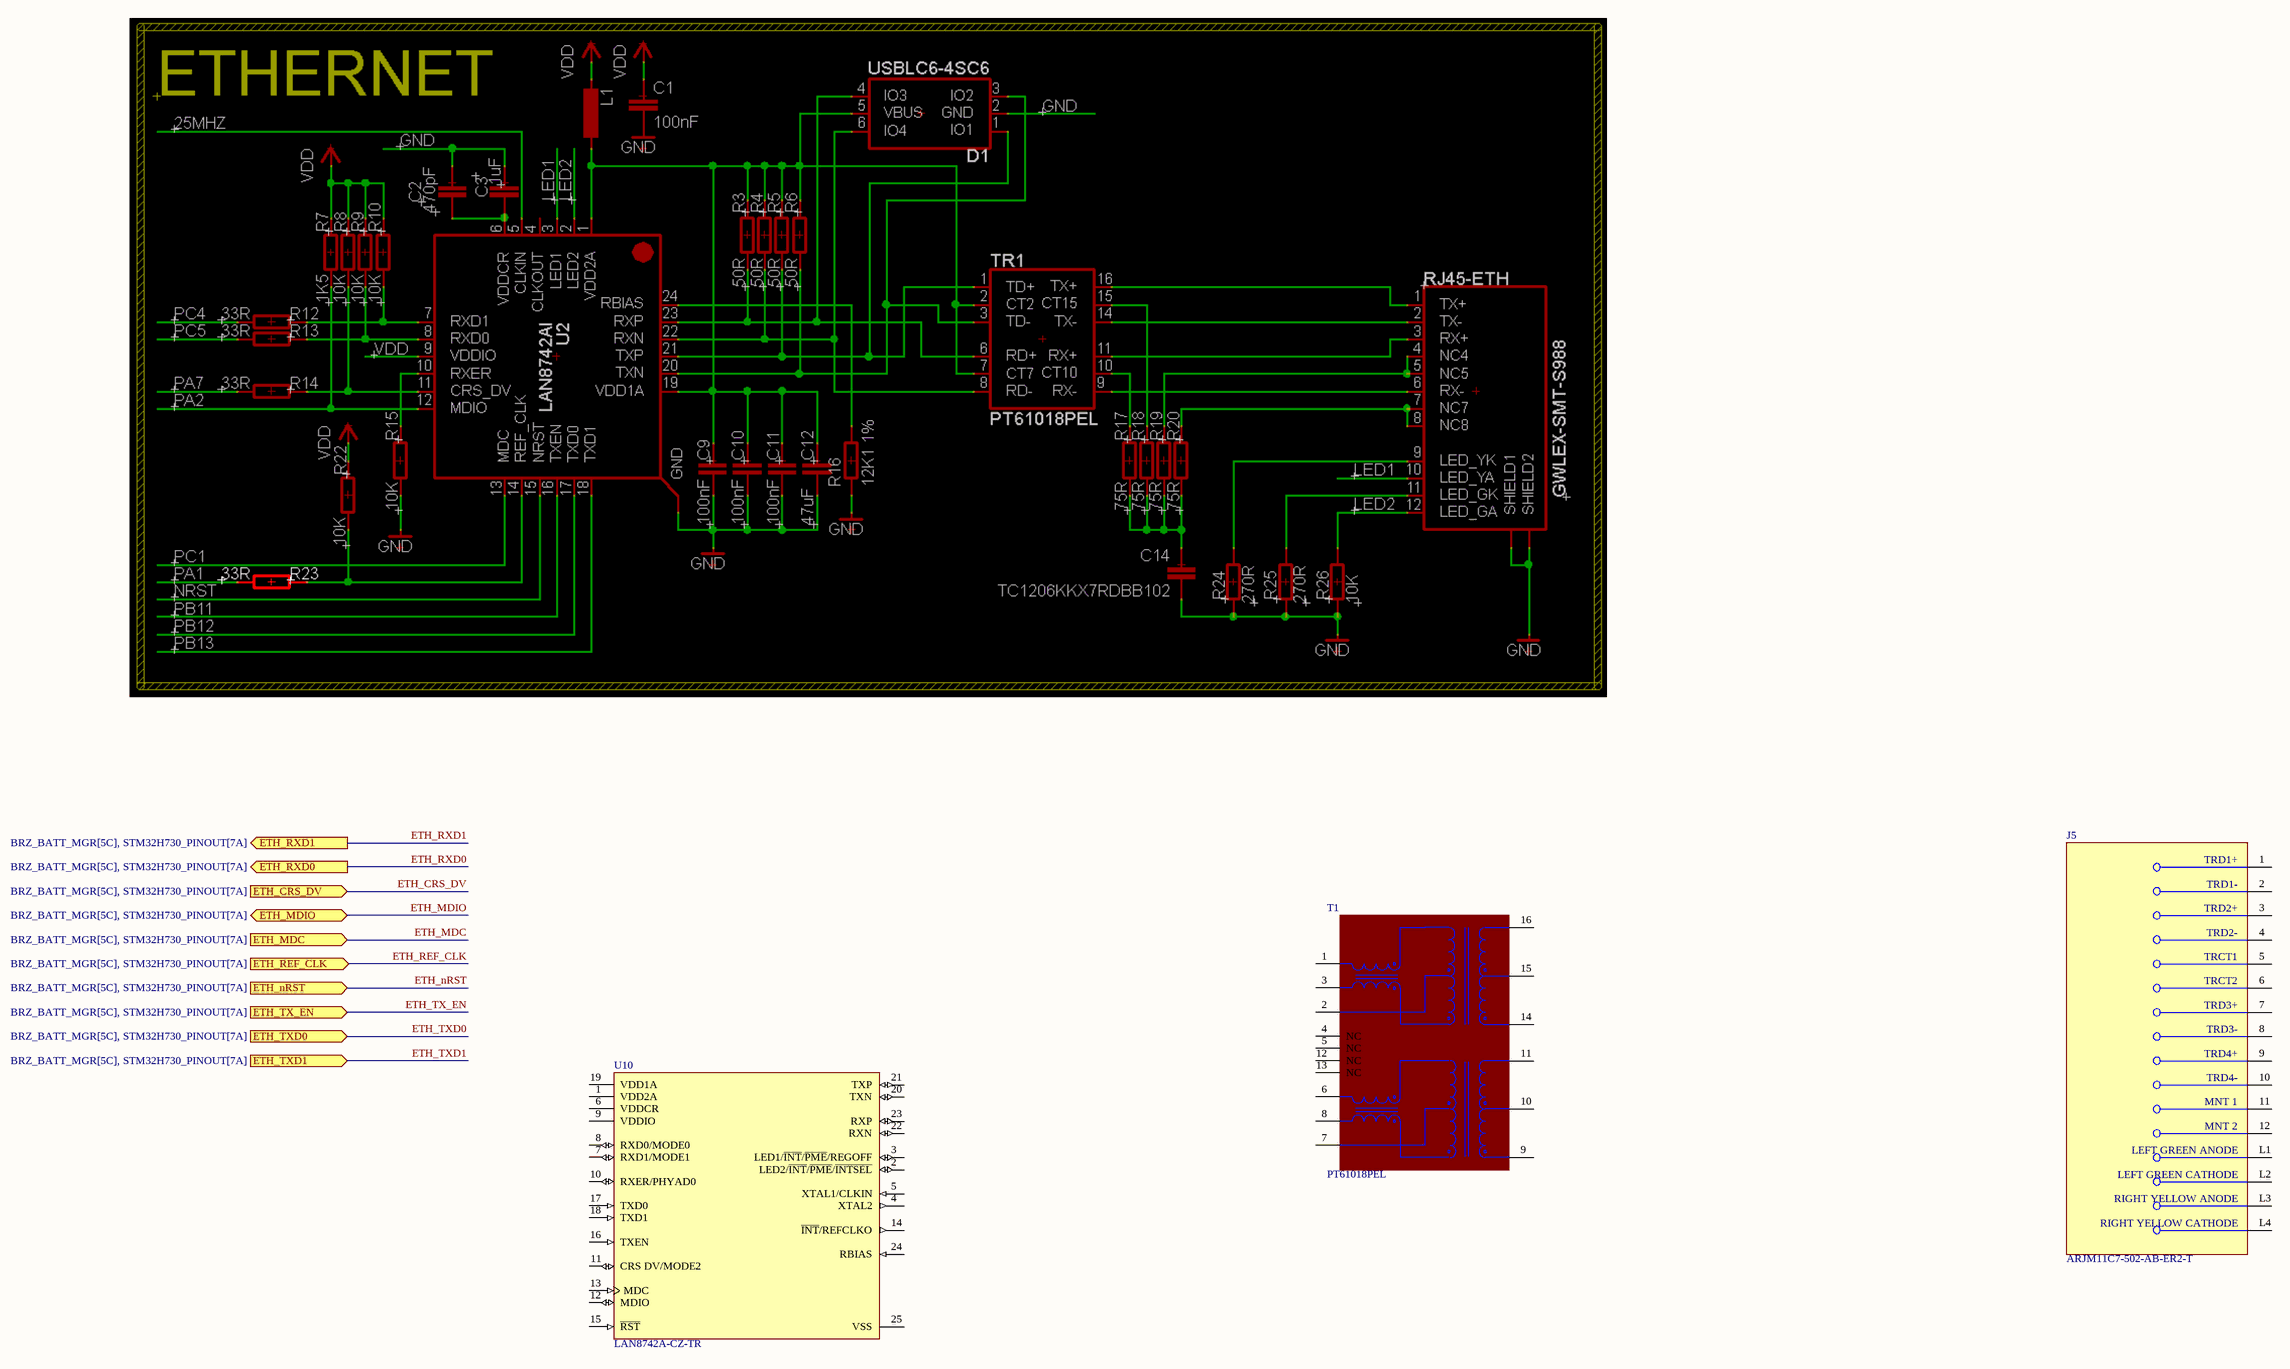
[diagram p12: ETH.SchDoc]

### Parts
J5  ARJM11C7-502-AB-ER2-T  [FP-ARJM11C7-502-AB-ER2-T-MFG]
T1  PT61018PEL  [FP-PT61018PEL-MFG]
U10  LAN8742A-CZ-TR  [FP-C04-143B-S4QFN-MFG]

### Ports
ETH_CRS_DV (in, see BRZ_BATT_MGR[5C], STM32H730_PINOUT[7A]), ETH_MDC (in, see BRZ_BATT_MGR[5C], STM32H730_PINOUT[7A]), ETH_MDIO (bidir, see BRZ_BATT_MGR[5C], STM32H730_PINOUT[7A]), ETH_nRST (in, see BRZ_BATT_MGR[5C], STM32H730_PINOUT[7A]), ETH_REF_CLK (in, see BRZ_BATT_MGR[5C], STM32H730_PINOUT[7A]), ETH_RXD0 (out, see BRZ_BATT_MGR[5C], STM32H730_PINOUT[7A]), ETH_RXD1 (out, see BRZ_BATT_MGR[5C], STM32H730_PINOUT[7A]), ETH_TX_EN (in, see BRZ_BATT_MGR[5C], STM32H730_PINOUT[7A]), ETH_TXD0 (in, see BRZ_BATT_MGR[5C], STM32H730_PINOUT[7A]), ETH_TXD1 (in, see BRZ_BATT_MGR[5C], STM32H730_PINOUT[7A])

### Nets

Not connected (* = marked no-connect by the designer): J5 1(TRD1+) 2(TRD1-) 3(TRD2+) 4(TRD2-) 5(TRCT1) 6(TRCT2) 7(TRD3+) 8(TRD3-) 9(TRD4+) 10(TRD4-) 11(MNT_1) 12(MNT_2) L1(LEFT_GREEN_ANODE) L2(LEFT_GREEN_CATHODE) L3(RIGHT_YELLOW_ANODE) L4(RIGHT_YELLOW_CATHODE); T1 1(TD+) 2(CT) 3(TD-) 4(NC) 5(NC) 6(RD+) 7(CT) 8(RD-) 9(RX-) 10(CT) 11(RX+) 12(NC) 13(NC) 14(TX-) 15(CT) 16(TX+); U10 1(VDD2A) 2(LED2/~{INT}/~{PME}/~{INTSEL}) 3(LED1/~{INT}/~{PME}/REGOFF) 4(XTAL2) 5(XTAL1/CLKIN) 6(VDDCR) 7(RXD1/MODE1) 8(RXD0/MODE0) 9(VDDIO) 10(RXER/PHYAD0) 11(CRS_DV/MODE2) 12(MDIO) 13(MDC) 14(~{INT}/REFCLKO) 15(~{RST}) 16(TXEN) 17(TXD0) 18(TXD1) 19(VDD1A) 20(TXN) 21(TXP) 22(RXN) 23(RXP) 24(RBIAS) 25(VSS)

### Library data of the parts
J5 = CMP-27893-000001-1: RJ45 JACK W/MAG 1X1 1000BASE-T; Manufacturer: Abracon; Conn Gender: Female; Is Female: yes; Shielding: true; Pitch: 1.27mm; Number Of Contacts: 10; Conn Orientation: Right Angle; RoHS: TRUE; Digikey Description: RJ45 JACK W/MAG 1X1 1000BASE-T; Temperature Range Low: -40°C; ComponentLink2Description: Datasheet; Category: Conn; Temperature Range High: +85°C; Package: 0; Device Class L1: Connectors; Manufacturer Part Number: ARJM11C7-502-AB-ER2-T; ComponentLink2URL: https://abracon.com/Magnetics/ARJM11.pdf; Automotive: No; Contact Material: Gold; Height: 15.8mm; Lead Free: Yes; Temperature: -40°C to +85°C; Device Class L2: Modular / Ethernet Connectors; Device Class L3: unset; Octopart: https://octopart.com/arjm11c7-502-ab-er2-t-abracon-86945316
T1 = CMP-07264-000008-1: PULSE XFMR 1CT:1CT 350UH; Max DC Current: 8mA; Shielding: Shielded; Lead/Base Style: Gull Wing; Isolation Voltage: 1.5kV; Turns Ratio: 1:1; DC Resistance (DCR): 1.2R; Weight: 0.02575oz; Termination: SMD/SMT; RoHS Compliant: Yes; Length: 12.8mm; Max Operating Temperature: 85°C; Inductance: 350uH; Mount: Surface Mount; Width: 6.9mm; Height: 5.65mm; Packaging: Tape and Reel; Case/Package: SMD/SMT; Number of Pins: 16; Min Operating Temperature: -40°C; Package Quantity: 600
U10 = CMP-06281-000006-2: IC TRANSCEIVER 1/1 24SQFN; Manufacturer: Microchip; Nominal Supply Current: 6.5-59mA; Max Supply Voltage: 3.6V; Number Of Channels: 1; Data Rate: 100Mbits/s; Interface: Ethernet,Other; Min Supply Voltage: 1.14V; Standoff Height: 0mm; Simplex Duplex: Full-Duplex; Height: 1mm; Ambient Temperature Range High: +70°C; Category: IC; Mouser Description: Small Footprint RMII 10/100 Ethernet Transceiver with flexPWR Technology; Manufacturer Part Number: LAN8742A-CZ-TR; Digikey Description: IC TRANSCEIVER 1/1 24SQFN; Octopart: https://octopart.com/lan8742a-cz-tr-microchip-29030587; Temperature: 0°C to +70°C; Ambient Temperature Range Low: 0°C; Temperature Range Low: 0°C; ComponentLink2Description: Datasheet; Automotive: No; RoHS: TRUE; Device Class L3: Ethernet Interface ICs; Device Class L1: Integrated Circuits (ICs); Device Class L2: Interface ICs; Lead Free: Yes; Ipc Land Pattern Name: QFN50P400X400X90-24; ComponentLink2URL: http://ww1.microchip.com/downloads/en/DeviceDoc/DS_LAN8742_00001989A.pdf; Temperature Range High: +70°C; Package: C04-143B-S4QFN

## Sheet START_JUMPER.SchDoc
size A4; SheetNumber: 9; SheetTotal: 9
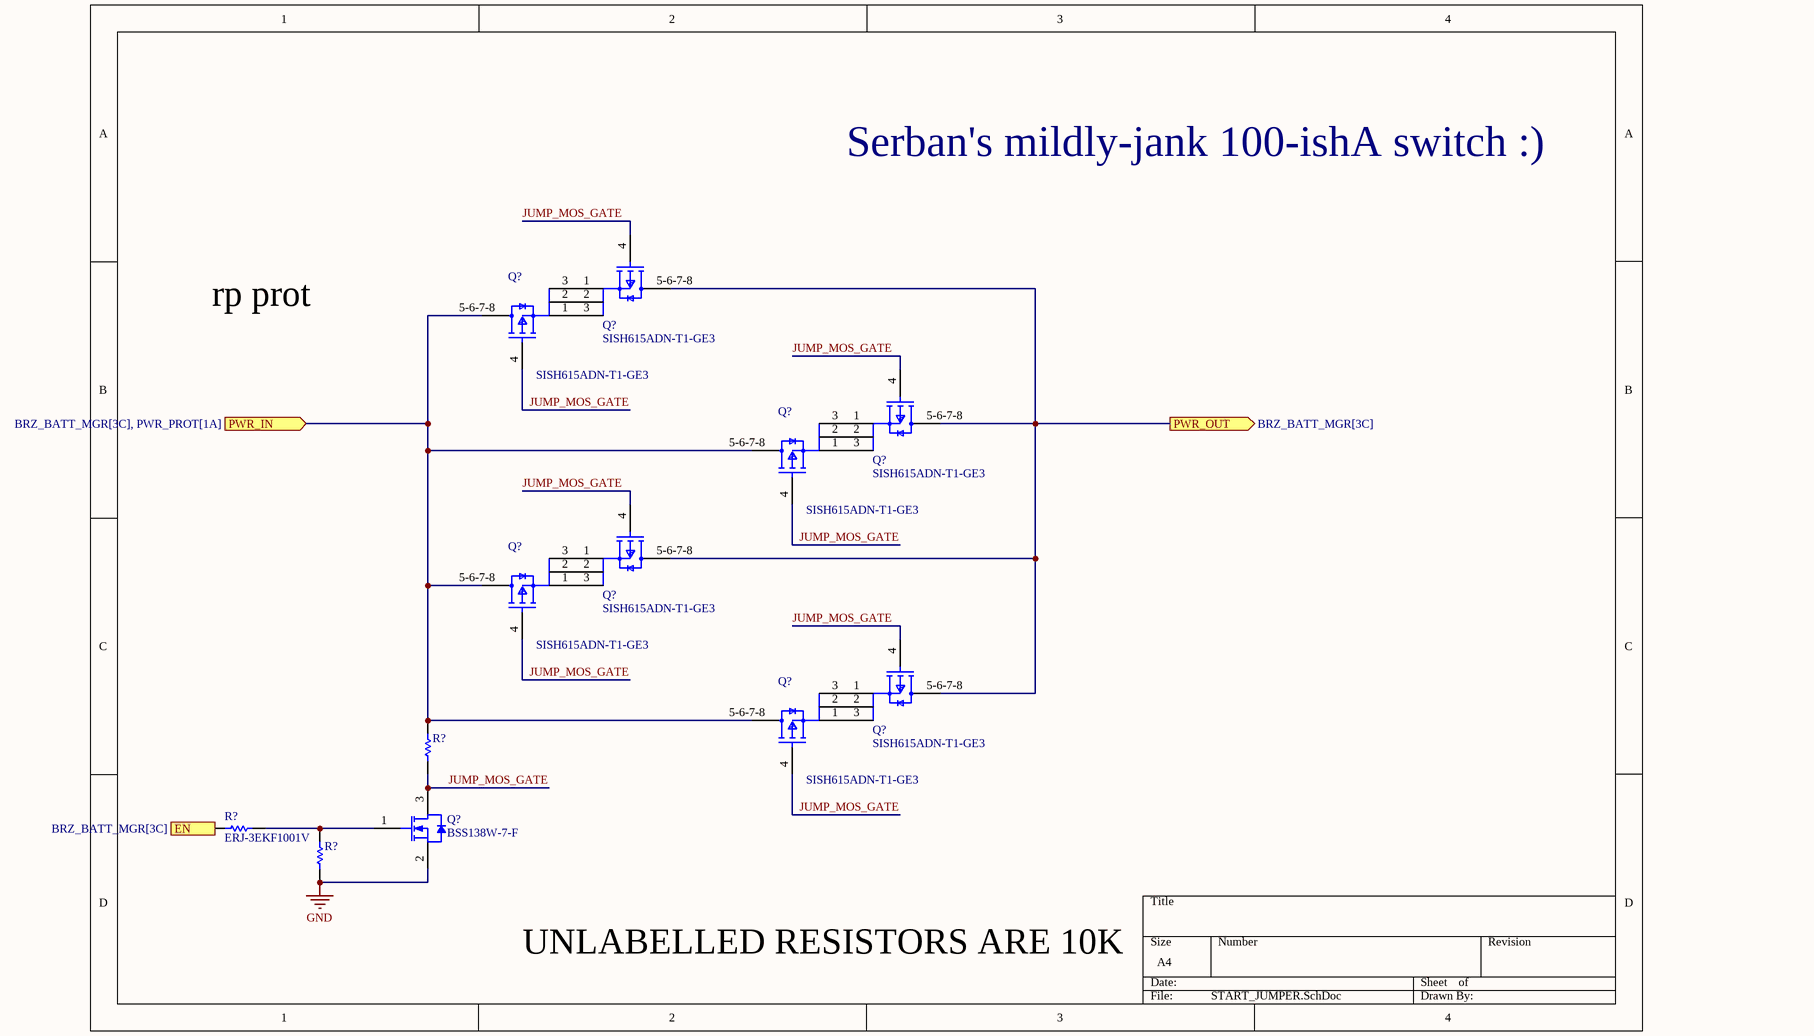
[diagram p13: START_JUMPER.SchDoc]

### Parts
(Parts that share a designator on the sheet are numbered #1, #2 ... from top to bottom, then left to right.)
Q?#5  SISH615ADN-T1-GE3  [SISH615ADN-T1-GE3-Footprint-1]
Q?#6  SISH615ADN-T1-GE3  [SISH615ADN-T1-GE3-Footprint-1]
Q?#7  SISH615ADN-T1-GE3  [SISH615ADN-T1-GE3-Footprint-1]
Q?#8  SISH615ADN-T1-GE3  [SISH615ADN-T1-GE3-Footprint-1]
Q?#9  SISH615ADN-T1-GE3  [SISH615ADN-T1-GE3-Footprint-1]
Q?#10  SISH615ADN-T1-GE3  [SISH615ADN-T1-GE3-Footprint-1]
Q?#11  SISH615ADN-T1-GE3  [SISH615ADN-T1-GE3-Footprint-1]
Q?#12  SISH615ADN-T1-GE3  [SISH615ADN-T1-GE3-Footprint-1]
Q?#13  BSS138W-7-F  [DIOD-SOT323-3_V]
R?#5  ERJ3EKF1002V  [RESC1609X55X30LL15T15]  (value not drawn)
R?#6  ERJ-3EKF1001V  [RESC1608X55X30LL15T15]
R?#7  ERJ3EKF1002V  [RESC1609X55X30LL15T15]  (value not drawn)

### Ports
EN (in, see BRZ_BATT_MGR[3C]), PWR_IN (in, see BRZ_BATT_MGR[3C], PWR_PROT[1A]), PWR_OUT (out, see BRZ_BATT_MGR[3C])

### Nets
GND: Q?#13.2(S) R?#7.1
PWR_IN: Q?#6.5-6-7-8(D) Q?#9.5-6-7-8(D) Q?#10.5-6-7-8(D) Q?#12.5-6-7-8(D) R?#5.2 ; port PWR_IN
CAR_PWR: Q?#5.5-6-7-8(D) Q?#7.5-6-7-8(D) Q?#8.5-6-7-8(D) Q?#11.5-6-7-8(D) ; port PWR_OUT
JUMP_MOS_GATE: Q?#5.4(G) Q?#6.4(G) Q?#7.4(G) Q?#8.4(G) Q?#9.4(G) Q?#10.4(G) Q?#11.4(G) Q?#12.4(G) Q?#13.3(D) R?#5.1
NetQ?#5_1: Q?#5.1(S) Q?#6.3(S)
NetQ?#5_2: Q?#5.2(S) Q?#6.2(S)
NetQ?#5_3: Q?#5.3(S) Q?#6.1(S)
NetQ?#7_1: Q?#7.1(S) Q?#9.3(S)
NetQ?#7_2: Q?#7.2(S) Q?#9.2(S)
NetQ?#7_3: Q?#7.3(S) Q?#9.1(S)
NetQ?#8_1: Q?#8.1(S) Q?#10.3(S)
NetQ?#8_2: Q?#8.2(S) Q?#10.2(S)
NetQ?#8_3: Q?#8.3(S) Q?#10.1(S)
NetQ?#11_1: Q?#11.1(S) Q?#12.3(S)
NetQ?#11_2: Q?#11.2(S) Q?#12.2(S)
NetQ?#11_3: Q?#11.3(S) Q?#12.1(S)
NetQ?#13_1: Q?#13.1(G) R?#6.1 R?#7.2

Not connected (* = marked no-connect by the designer): R?#6 2

### Notes on the sheet
- Serban's mildly-jank 100-ishA switch :)
- rp prot
- UNLABELLED RESISTORS ARE 10K

### Library data of the parts
Q?#5-Q?#12 = CMP-013-00036-1: Trans MOSFET P-CH 20V 22.1A 8-Pin PowerPAK 1212 EP T/R
Q?#13 = CMP-2000-05968-1: N-Channel Enhancement Mode Mosfet, 50 V, 200 mA, -55 to 150 degC, 6-Pin SOT-323, RoHS, Tape and Reel; Typical Turn-Off Delay Time: 20ns; Number of Channels: 1Channel; Type: EnhancementModeFieldEffectTransistor; Brand: DiodesIncorporated; Vds - Drain-Source Breakdown Voltage: 75V; Vgs - Gate-Source Voltage: 20V; Rds On - Drain-Source Resistance: 1.4Ohms; Transistor Type: 1N-Channel; Configuration: Single; Unit Weight: 0.000212oz; Pd - Power Dissipation: 200mW; Id - Continuous Drain Current: 200mA; Forward Transconductance - Min: 0.1S; Manufacturer URL: http://www.diodes.com/; Series: BSS138; Package Description: 3-Pin Small Outline Transistor, Body 2 x 1.25 mm, Pitch 0.65 mm; Mounting Technology: SurfaceMount; Product Category: MOSFET; RoHS: True; Maximum Operating Temperature: +150C; Height: 1mm; Length: 2.2mm; Technology: Si; Width: 1.35mm; Datasheet URL: http://www.diodes.com/_files/datasheets/ds30206.pdf; Manufacturer: DiodesIncorporated; Package / Case: SOT-323-3; Typical Turn-On Delay Time: 20ns; Transistor Polarity: N-Channel; Factory Pack Quantity: 3000; Packaging: Reel; Product: MOSFETSmallSignal; Datasheet Version: Rev. 11-2, 09/2013; Package Reference: SOT323; Minimum Operating Temperature: -55C; Mounting Style: SMD/SMT; Channel Mode: Enhancement
R?#5 R?#7 = CMP-1012-00623-3: as R3 on sheet STM32H730_PINOUT; Number of Pins: 2; Package Reference: 603; Depth: 0.8mm; Mount: SurfaceMount; Package Description: 2-Pin Surface Mount Device, Body 1.6 x 0.85 mm; Datasheet Version: 02/2017; Length: 1.6mm; Lead Free: LeadFree; Height: 0.45mm; Number of Terminations: 2; Max Power Dissipation: 100mW; Min Operating Temperature: -55degC; Datasheet URL: https://industrial.panasonic.com/cdbs/www-data/pdf/RDA0000/AOA0000C304.pdf; Termination: SMD/SMT; Case Code (Metric): 1608; Case Code (Imperial): 0603; Tolerance: 1%; Max Operating Temperature: 155degC; RoHSCompliant: true; Voltage Rating (DC): 75V; Radiation Hardening: No; Packaging: TapeandReel; Composition: ThickFilm; Mounting Technology: SurfaceMount; Manufacturer URL: http://www.panasonic.com/; Width: 0.031inch; REACH SVHC: NoSVHC; Contact Plating: Tin; Military Standard: Not; Package Quantity: 1
R?#6 = CMP-2000-00180-1: Manufacturer: Panasonic; Part Number: ERJ-3EKF1001V

## Nets that join several sheets
3V3: INT_REG (5 pins), BATT_CHG (R61.2 R62.2 R72.2 R73.2), STM32H730_PINOUT (32 pins), CAN_IF_0 (C46_CAN_IF_0.1 U2_CAN_IF_0.5), CAN_IF_1 (C46_CAN_IF_1.1 U2_CAN_IF_1.5)
5V: INT_REG (C31.1 R59.2 U8.2 U8.4), CAN_IF_0 (C45_CAN_IF_0.1 U2_CAN_IF_0.3), CAN_IF_1 (C45_CAN_IF_1.1 U2_CAN_IF_1.3)
GND: BRZ_BATT_MGR (10 pins), PWR_PROT_0 (15 pins), INT_REG (12 pins), BATT_CHG (19 pins), STM32H730_PINOUT (45 pins), PWR_PROT_2 (15 pins), CAN_IF_0 (10 pins), CAN_IF_1 (10 pins), START_JUMPER (Q?#13.2 R?#7.1)
PWR_IN: BATT_CHG (F3.2), PWR_PROT_2 (F1_PWR_PROT_2.1 R35_PWR_PROT_2.2 R39_PWR_PROT_2.1), CAN_IF_0 (D5_CAN_IF_0.2), START_JUMPER (5 pins)
PWR_OUT: PWR_PROT_0 (Q6_PWR_PROT_0.5-6-7-8), INT_REG (D?#1.2), BATT_CHG (F2.1)
PWR_OUT: INT_REG (Q?#3.5-6-7-8 U?.1), PWR_PROT_2 (Q6_PWR_PROT_2.5-6-7-8)
CAN1_RX: STM32H730_PINOUT (R15.1 U1.81), CAN_IF_0 (U2_CAN_IF_0.4)
CAN1_TX: STM32H730_PINOUT (R21.1 U1.82), CAN_IF_0 (U2_CAN_IF_0.1)
CAN_INH: INT_REG (D?#2.2), CAN_IF_0 (U2_CAN_IF_0.7)
CAN_INH: INT_REG (D?#3.2), CAN_IF_1 (U2_CAN_IF_1.7)
CAN_PWR: BRZ_BATT_MGR (J3.5 J3.6), CAN_IF_1 (D5_CAN_IF_1.2)
CAR_PWR: PWR_PROT_0 (F1_PWR_PROT_0.1 R35_PWR_PROT_0.2 R39_PWR_PROT_0.1), START_JUMPER (Q?#5.5-6-7-8 Q?#7.5-6-7-8 Q?#8.5-6-7-8 Q?#11.5-6-7-8)
INT_3V3_SENSE: INT_REG (R57.1 R58.2), STM32H730_PINOUT (U3.7)
INT_5V_SENSE: INT_REG (R59.1 R60.1), STM32H730_PINOUT (U3.6)